# Altium project Thesis_NRF.PrjPcb
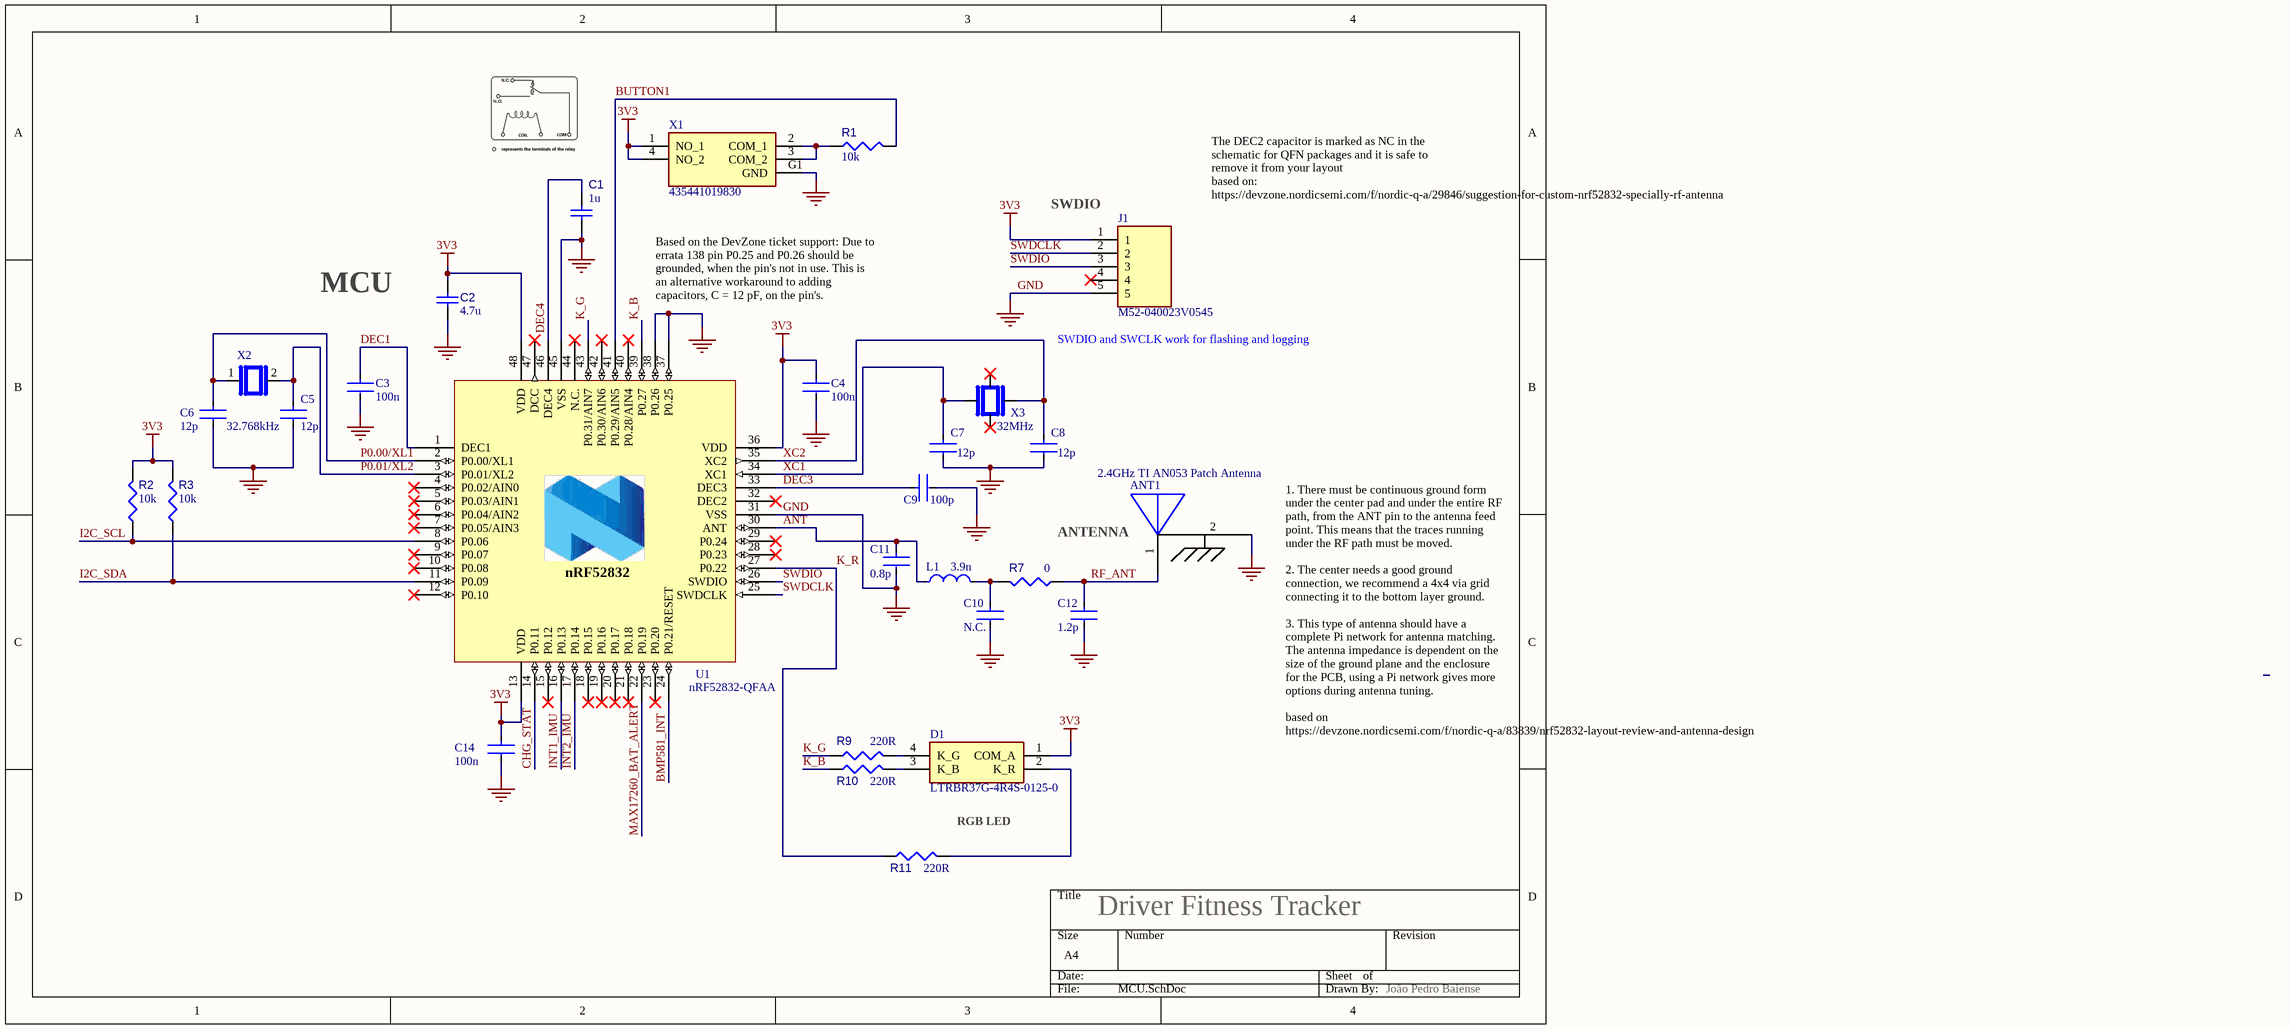
[diagram p0: MCU.SchDoc]
Author: João Pedro Baiense; Date: 14/07/2023; Description: Master's thesis project in Electrotechnical Engineering
3 sheets, 55 parts. Net scope: global (net labels, ports and power ports of the same name join across sheets).
Board file: DriverFitTracker.PcbDoc
Sheets:
  MCU.SchDoc
  PMIC_USB.SchDoc
  SENSORS.SchDoc

## Sheet MCU.SchDoc
size A4; SheetNumber: 1; SheetTotal: 3

### Parts
ANT1  2.4GHz TI AN053 Patch Antenna  [2.4GHz TI AN053 Patch Antenna Right Original]  (no BOM)
C1  1u  [CAPC1608X90X40NL10T20]
C2  4.7u  [CAPC1608X90X40NL10T20]
C3  100n  [FP-C0402-BB-MFG]
C4  100n  [FP-C0402-BB-MFG]
C5  12p  [FP-C0402-BB-MFG]
C6  12p  [FP-C0402-BB-MFG]
C7  12p  [FP-C0402-BB-MFG]
C8  12p  [FP-C0402-BB-MFG]
C9  100p  [FP-C0402-BB-MFG]
C10  N.C.  [FP-C0402-BB-MFG]
C11  0.8p  [FP-C0402-BB-MFG]
C12  1.2p  [FP-C0402-BB-MFG]
C14  100n  [FP-C0402-BB-MFG]
D1  LTRBR37G-4R4S-0125-0  [RGBLED_LTRBR37G4R4S01250]
J1  M52-040023V0545  [5_PINS_HEADER_HDRV5W46P0X127_1X5_635X250X650P]
L1  3.9n  [FP-LQW15AN_00-W0_6-0_1-MFG]
R1  10k  [RESC0402(1005)_L]
R2  10k  [RESC0402(1005)_L]
R3  10k  [RESC0402(1005)_L]
R7  value 0  [RESC0402(1005)_L]  (hidden comment: 0R)
R9  220R  [RESC0402(1005)_L]
R10  220R  [RESC0402(1005)_L]
R11  220R  [RESC0402(1005)_L]
U1  nRF52832-QFAA  [QFN40P600X600X90-48N]
X1  435441019830  [BUTTON_435441019830]
X2  32.768kHz  [CRYSTAL_XTAL_CM8V-T1A-32.768KHZ-9PF-20PPM-TA-QC]
X3  32MHz  [OSC_XRCGB32M000F1H01R0]

### Nets
3V3: C2.1 C4.1 C14.1 D1.1(COM_A) J1.1 R2.2 R3.2 U1.13(VDD) U1.36(VDD) U1.48(VDD) X1.1(NO_1) X1.4(NO_2)  [project net OUT]
GND: ANT1.2 C1.2 C2.2 C3.2 C4.2 C5.2 C6.2 C7.2 C8.2 C9.2 C10.2 C11.2 C12.2 C14.2 J1.5 U1.31(VSS) U1.37(P0.25) U1.38(P0.26) U1.45(VSS) U1.49(GND) X1.G1(GND)
ANT: C11.1 L1.1 U1.30(ANT)
BMP581_INT: U1.24(P0.21/RESET)
BUTTON1: R1.2 U1.41(P0.29/AIN5)
CHG_STAT: U1.14(P0.11)
DEC1: C3.1 U1.1(DEC1)
DEC3: C9.1 U1.33(DEC3)
DEC4: C1.1 U1.46(DEC4)
I2C_SCL: R2.1 U1.8(P0.06)
I2C_SDA: R3.1 U1.11(P0.09)
INT1_IMU: U1.16(P0.13)
INT2_IMU: U1.17(P0.14)
K_B: R10.1 U1.39(P0.27)
K_G: R9.1 U1.43(P0.31/AIN7)
K_R: R11.1 U1.27(P0.22)
MAX17260_BAT_ALERT: U1.22(P0.19)
P0.00/XL1: C6.1 U1.2(P0.00/XL1) X2.1
P0.01/XL2: C5.1 U1.3(P0.01/XL2) X2.2
RF_ANT: ANT1.1(ANT) C12.1 R7.1
SWDCLK: J1.2 U1.25(SWDCLK)
SWDIO: J1.3 U1.26(SWDIO)
XC1: C7.1 U1.34(XC1) X3.1
XC2: C8.1 U1.35(XC2) X3.3
NetC10_1: C10.1 L1.2 R7.2
NetD1_2: D1.2(K_R) R11.2
NetD1_3: D1.3(K_B) R10.2
NetD1_4: D1.4(K_G) R9.2
NetR1_1: R1.1 X1.2(COM_1) X1.3(COM_2)

Not connected (* = marked no-connect by the designer): J1 4*; U1 4(P0.02/AIN0)* 5(P0.03/AIN1)* 6(P0.04/AIN2)* 7(P0.05/AIN3)* 9(P0.07)* 10(P0.08)* 12(P0.10)* 15(P0.12)* 18(P0.15)* 19(P0.16)* 20(P0.17)* 21(P0.18)* 23(P0.20)* 28(P0.23)* 29(P0.24)* 32(DEC2)* 40(P0.28/AIN4)* 42(P0.30/AIN6)* 44(N.C.)* 47(DCC)*; X3 2* 4*

### Notes on the sheet
- (near J1) SWDIO
- The DEC2 capacitor is marked as NC in the schematic for QFN packages and it is safe to remove it from your layout
  based on: https://devzone.nordicsemi.com/f/nordic-q-a/29846/suggestion-for-custom-nrf52832-specially-rf-antenna
- MCU
- Based on the DevZone ticket support: Due to errata 138 pin P0.25 and P0.26 should be grounded, when the pin's not in use. This is an alternative workaround to adding capacitors, C = 12 pF, on the pin's.
- (near J1) SWDIO and SWCLK work for flashing and logging
- ANTENNA
- 1. There must be continuous ground form under the center pad and under the entire RF path, from the ANT pin to the antenna feed point. This means that the traces running under the RF path must be moved.
  2. The center needs a good ground connection, we recommend a 4x4 via grid connecting it to the bottom layer ground.
  3. This type of antenna should have a complete Pi network for antenna matching. The antenna impedance is dependent on the size of the ground plane and the enclosure for the PCB, using a Pi network gives more options during antenna tuning.
  based on https://devzone.nordicsemi.com/f/nordic-q-a/83839/nrf52832-layout-review-and-antenna-design
- Type @ to refer to a designator or a net
- RGB LED
- Driver Fitness Tracker
- João Pedro Baiense
- (in symbol nRF52832_QFAA) nRF52832

### Library data of the parts
ANT1 = 2.4GHz Antenna with GND: From Application Note AN053
C1 = CMP-001-00017-6: Multilayer Ceramic Capacitors MLCC - SMD/SMT 50V 1uF X7R 0603 10%; CorrectManufacturer: 06035C105KAT2A; Tolerance: 10%; Voltage Rating: 50V; Mounting Technology: SM; Value: 1u; Max Operating Temperature: 125°C; RoHS Compliant: True; Pins: 2; Capacitor Type: Ceramic; Case/Package: 0603; Min Operating Temperature: -55°C; JLCPCB Part #: C15849
C2 = CMP-001-00017-6: Chip Capacitor, 100 nF, +/- 10%, 50 V, 0603 (1608 Metric); CorrectManufacturer: 0603YW475KAT2A; Voltage Rating: 50V; Capacitor Type: Ceramic; Tolerance: 10%; Mounting Technology: SM; Value: 4.7u; Max Operating Temperature: 125°C; RoHS Compliant: True; Pins: 2; Case/Package: 0603; Min Operating Temperature: -55°C; JLCPCB Part #: C14663
C3 C4 C14 = CMP-2008-02046-2: Multilayer Ceramic Capacitors MLCC - SMD/SMT NEW GLOBAL PN KGM05CR71H104KN 50V 0.1uF X7R 0402 10%; Manufacturer: Kemet; CorrectManufacturer: 04025C104KAT4A; Capacitance: 0.10 μF; Temperature Characteristic: X5R; Temperature Coefficient: 15%; Tolerance: 0.1; Voltage Rating: 10 V; Value: 0.10 μF; Material: Ceramic; Package: C0402-BB; Temperature: -55°C to +125°C; ComponentLink2Description: Datasheet; Device Class L1: Passive Components; Height: 0.55mm; Lead Free: Yes; ComponentLink2URL: https://content.kemet.com/datasheets/KEM_C1002_X7R_SMD.pdf; Device Class L2: Capacitors; Temperature Range Low: -55°C; Temperature Range High: +125°C; RoHS: TRUE; Octopart: https://octopart.com/c0402c104k8pactu-kemet-140039; Automotive: No; Mouser Description: Capacitor 100 nF 10 VDC 0402; Category: Cap; Digikey Description: CAP CER 0.1UF 10V X5R 0402; Ipc Land Pattern Name: CAPC10050X50; Device Class L3: Ceramic Capacitors; JLCPCB Part #: C1523
C5-C8 = CMP-2008-02046-2: Multilayer Ceramic Capacitors MLCC - SMD/SMT 12 pF 50 VDC 5% 0402 C0G (NP0); Manufacturer: Kemet; CorrectManufacturer: GRM1555C1H120JA01D; Capacitance: 0.10 μF; Temperature Characteristic: X5R; Temperature Coefficient: 15%; Tolerance: 0.1; Voltage Rating: 10 V; Value: 0.10 μF; Material: Ceramic; Package: C0402-BB; Temperature: -55°C to +125°C; ComponentLink2Description: Datasheet; Device Class L1: Passive Components; Height: 0.55mm; Lead Free: Yes; ComponentLink2URL: https://content.kemet.com/datasheets/KEM_C1002_X7R_SMD.pdf; Device Class L2: Capacitors; Temperature Range Low: -55°C; Temperature Range High: +125°C; RoHS: TRUE; Octopart: https://octopart.com/c0402c104k8pactu-kemet-140039; Automotive: No; Mouser Description: Capacitor 100 nF 10 VDC 0402; Category: Cap; Digikey Description: CAP CER 0.1UF 10V X5R 0402; Ipc Land Pattern Name: CAPC10050X50; Device Class L3: Ceramic Capacitors; JLCPCB Part #: C1547
C9 = CMP-2008-02046-2: Multilayer Ceramic Capacitors MLCC - SMD/SMT 100 pF 50 VDC 5% 0402 C0G (NP0); Manufacturer: Kemet; CorrectManufacturer: GRM1555C1H101JA01D; Capacitance: 0.10 μF; Temperature Characteristic: X5R; Temperature Coefficient: 15%; Tolerance: 0.1; Voltage Rating: 10 V; Value: 0.10 μF; Material: Ceramic; Package: C0402-BB; Temperature: -55°C to +125°C; ComponentLink2Description: Datasheet; Device Class L1: Passive Components; Height: 0.55mm; Lead Free: Yes; ComponentLink2URL: https://content.kemet.com/datasheets/KEM_C1002_X7R_SMD.pdf; Device Class L2: Capacitors; Temperature Range Low: -55°C; Temperature Range High: +125°C; RoHS: TRUE; Octopart: https://octopart.com/c0402c104k8pactu-kemet-140039; Automotive: No; Mouser Description: Capacitor 100 nF 10 VDC 0402; Category: Cap; Digikey Description: CAP CER 0.1UF 10V X5R 0402; Ipc Land Pattern Name: CAPC10050X50; Device Class L3: Ceramic Capacitors; JLCPCB Part #: C1546
C10 = CMP-2008-02046-2: DO NOT CONNECT THIS CAPACITOR - RF PURPOSE; CorrectManufacturer: NOT_CONNECT; ComponentLink2Description: Datasheet; ComponentLink2URL: https://content.kemet.com/datasheets/KEM_C1002_X7R_SMD.pdf
C11 = CMP-2008-02046-2: Multilayer Ceramic Capacitors MLCC - SMD/SMT 0.8 pF 50 VDC 0.05 pF 0402 C0G (NP0) AEC-Q200; Manufacturer: Murata Electronics; CorrectManufacturer: GCQ1555C1HR80WB01D; Capacitance: 0.10 μF; Temperature Characteristic: X5R; Temperature Coefficient: 15%; Tolerance: 0.1; Voltage Rating: 10 V; Material: Ceramic; Package: C0402-BB; Temperature: -55°C to +125°C; ComponentLink2Description: Datasheet; Device Class L1: Passive Components; Height: 0.55mm; Lead Free: Yes; ComponentLink2URL: https://content.kemet.com/datasheets/KEM_C1002_X7R_SMD.pdf; Device Class L2: Capacitors; Temperature Range Low: -55°C; Temperature Range High: +125°C; RoHS: TRUE; Octopart: https://octopart.com/c0402c104k8pactu-kemet-140039; Automotive: No; Mouser Description: Capacitor 100 nF 10 VDC 0402; Category: Cap; Digikey Description: CAP CER 0.1UF 10V X5R 0402; Ipc Land Pattern Name: CAPC10050X50; Device Class L3: Ceramic Capacitors; JLCPCB Part #: C172820
C12 = CMP-2008-02046-2: Multilayer Ceramic Capacitors MLCC - SMD/SMT NEW GLOBAL PN KGM05ACG1H1R2BN 50V 1.2pF C0G 0402 .1pF Tol; Manufacturer: Kemet; CorrectManufacturer: 04025A1R2BAT4A; Capacitance: 0.10 μF; Temperature Characteristic: X5R; Temperature Coefficient: 15%; Tolerance: 0.1; Voltage Rating: 10 V; Value: 0.10 μF; Material: Ceramic; Package: C0402-BB; Temperature: -55°C to +125°C; ComponentLink2Description: Datasheet; Device Class L1: Passive Components; Height: 0.55mm; Lead Free: Yes; ComponentLink2URL: https://content.kemet.com/datasheets/KEM_C1002_X7R_SMD.pdf; Device Class L2: Capacitors; Temperature Range Low: -55°C; Temperature Range High: +125°C; RoHS: TRUE; Octopart: https://octopart.com/c0402c104k8pactu-kemet-140039; Automotive: No; Mouser Description: Capacitor 100 nF 10 VDC 0402; Category: Cap; Digikey Description: CAP CER 0.1UF 10V X5R 0402; Ipc Land Pattern Name: CAPC10050X50; Device Class L3: Ceramic Capacitors; JLCPCB Part #: C76955
D1 = RGBLED_LTRBR37G-4R4S-0125-0: Standard LEDs - SMD LTRBR37G; Manufacturer_Name: ams OSRAM; Geometry.Height: 0.35mm; Mouser Part Number: 720-LTRBR37GA6714; Mouser Price/Stock: https://www.mouser.co.uk/ProductDetail/ams-OSRAM/LTRBR37G-4R4S-0125-0?qs=vvQtp7zwQdPO5tl4HQ7ftA%3D%3D; CorrectManufacturer: LTRBR37G-4R4S-0125-0; Datasheet Link: https://dammedia.osram.info/media/resource/hires/osram-dam-24639129/LTRB%20R37G_EN.pdf
J1 = 5_PINS_HEADER_M52-040023V0545: Headers & Wire Housings Pin1.27mm Tail,Vert SIL, 5P, Single Row; Manufacturer_Name: Harwin; Geometry.Height: 6.5mm; CorrectManufacturer: M52-040023V0545; Mouser Part Number: 855-M52-040023V0545; Mouser Price/Stock: https://www.mouser.co.uk/ProductDetail/Harwin/M52-040023V0545?qs=wuXwK9wHm9ubXDya5zRNiw%3D%3D; Arrow Part Number: *; Arrow Price/Stock: *; Datasheet Link: https://cdn.harwin.com/pdfs/M52-040023VXX45.pdf
L1 = CMP-06042-000827-1: RF Inductors - SMD 01005, 3.9nH +-0.2nH S-HQ SMD RF IND; CorrectManufacturer: MHQ0402PSA3N9CT000; Shielding: Unshielded; Self Resonant Frequency: 10GHz; Core Material: Air; Current: 750mA; Test Frequency: 100MHz; DC Resistance (DCR): 70mR; Length: 1mm; Inductance: 3.9nH; Height: 0.5mm; Case Code (Metric): 1005; Lead Free: Lead Free; Military Standard: Not; Mount: Surface Mount; REACH SVHC: No SVHC; Current Rating: 750mA; DC Current: 750mA; Max Operating Temperature: 125°C; Package Quantity: 10000; Packaging: Tape and Reel; Case/Package: 0402; Min Operating Temperature: -55°C; Width: 0.02inch; Depth: 0.7mm; Termination: SMD/SMT; Weight: 2.8E-05oz; Number of Pins: 2; Radiation Hardening: No; Max DC Current: 750mA; JLCPCB Part #: C14033
R1-R3 = CMP-009-00149-3: Thin Film Resistors - SMD 1/16W 10K ohm 1% 50ppm; CorrectManufacturer: RT0402FRE0710KL; Power: 63mW; Min Operating Temperature: -55°C; Tolerance: 1%; Case/Package: 0402; Max Operating Temperature: 155°C; Value: 10k; Pins: 2; JLCPCB Part #: C25744
R7 = CMP-009-00149-3: Thin Film Resistors - SMD MCS 0402 VG01 E1 0R0; CorrectManufacturer: MCS0402HZ0000ZE100; Power: 63mW; Tolerance: 1%; Min Operating Temperature: -55°C; Case/Package: 0402; Max Operating Temperature: 155°C; Pins: 2
R9-R11 = CMP-009-00149-3: Thin Film Resistors - SMD .063W 220ohms 1% 0402 50ppm; CorrectManufacturer: MCS04020C2200FE000; Power: 63mW; Min Operating Temperature: -55°C; Tolerance: 1%; Case/Package: 0402; Max Operating Temperature: 155°C; Value: 220R; Pins: 2; JLCPCB Part #: C25744
U1 = nRF52832_QFAA: Multi-protocol Bluetooth Low Energy, ANT and 2.4GHz proprietary system-on-chip; Manufacturer: Nordic Semiconductor; CorrectManufacturer: nRF52832-QFAA-R; Artikkelnr Noca: N.A.; Part Number: nRF52832-QFAA; Datasheet: *; LatestRevisionDate: 2014-11-26; Pin Count: 48; Publisher: Nordic Semiconductor; Published: 2014-11-26; Value: nRF52832-QFAA; Note: *; Supplier: Nordic Semiconductor; Supplier part number: *; 2nd source Supplier: *; 2nd source part number: *; Footprint Doc: QFN-48; Artikkelnr Simpro: N.A.; JLCPCB Link: https://jlcpcb.com/partdetail/NordicSemicon-NRF52832_QFAAR/C77540; JLCPCB Part #: C77540
X1 = BUTTON_435441019830: Tactile Switches WS-TASV Tact Switch Washable 4.1x2.8x1.9 mm SMT; Manufacturer_Name: Wurth Elektronik; Geometry.Height: 1.9mm; Mouser Part Number: 710-435441019830; Mouser Price/Stock: https://www.mouser.co.uk/ProductDetail/Wurth-Elektronik/435441019830?qs=ufv2HEpFn%252BQgnhl%2FsZ0Vfw%3D%3D; CorrectManufacturer: 435441019830; Datasheet Link: https://www.we-online.com/catalog/datasheet/435441019830.pdf
X2 = CRYSTAL_32K: Crystals 32.768 kHz 9.0 pF +/-20 PPM -40/+85C; CorrectManufacturer: CM8V-T1A-32.768KHZ-9PF-20PPM-TA-QC; MF: Micro Crystal; SnapEDA_Link: https://www.snapeda.com/parts/CM8V-T1A-32.768KHZ-9PF-20PPM-TA-QC/Micro+Crystal/view-part/?ref=snap; Package: SMD-2 Micro Crystal; Value: *; Check_prices: https://www.snapeda.com/parts/CM8V-T1A-32.768KHZ-9PF-20PPM-TA-QC/Micro+Crystal/view-part/?ref=eda
X3 = XRCGB32M000F1H01R0: Crystals 32 MHZ 10PPM 2.0X1.6X; is Basic Part?: No; MF: Murata Electronics; Package: SMD-4 Murata; Availability: In Stock; Value: *; CorrectManufacturer: XRCGB32M000F1H01R0; Purchase-URL: https://pricing.snapeda.com/search/part/XRCGB32M000F1H01R0/?ref=eda; Check_prices: https://www.snapeda.com/parts/XRCGB32M000F1H01R0/Murata/view-part/?ref=eda; Price: None; SnapEDA_Link: https://www.snapeda.com/parts/XRCGB32M000F1H01R0/Murata/view-part/?ref=snap; Available at JLCPCB?: Yes; JLCPCB Link: https://jlcpcb.com/partdetail/985230-XRCGB32M000F1H01R0/C914155; JLCPCB Part #: C914155

## Sheet PMIC_USB.SchDoc
size A4; SheetNumber: 2; SheetTotal: 3
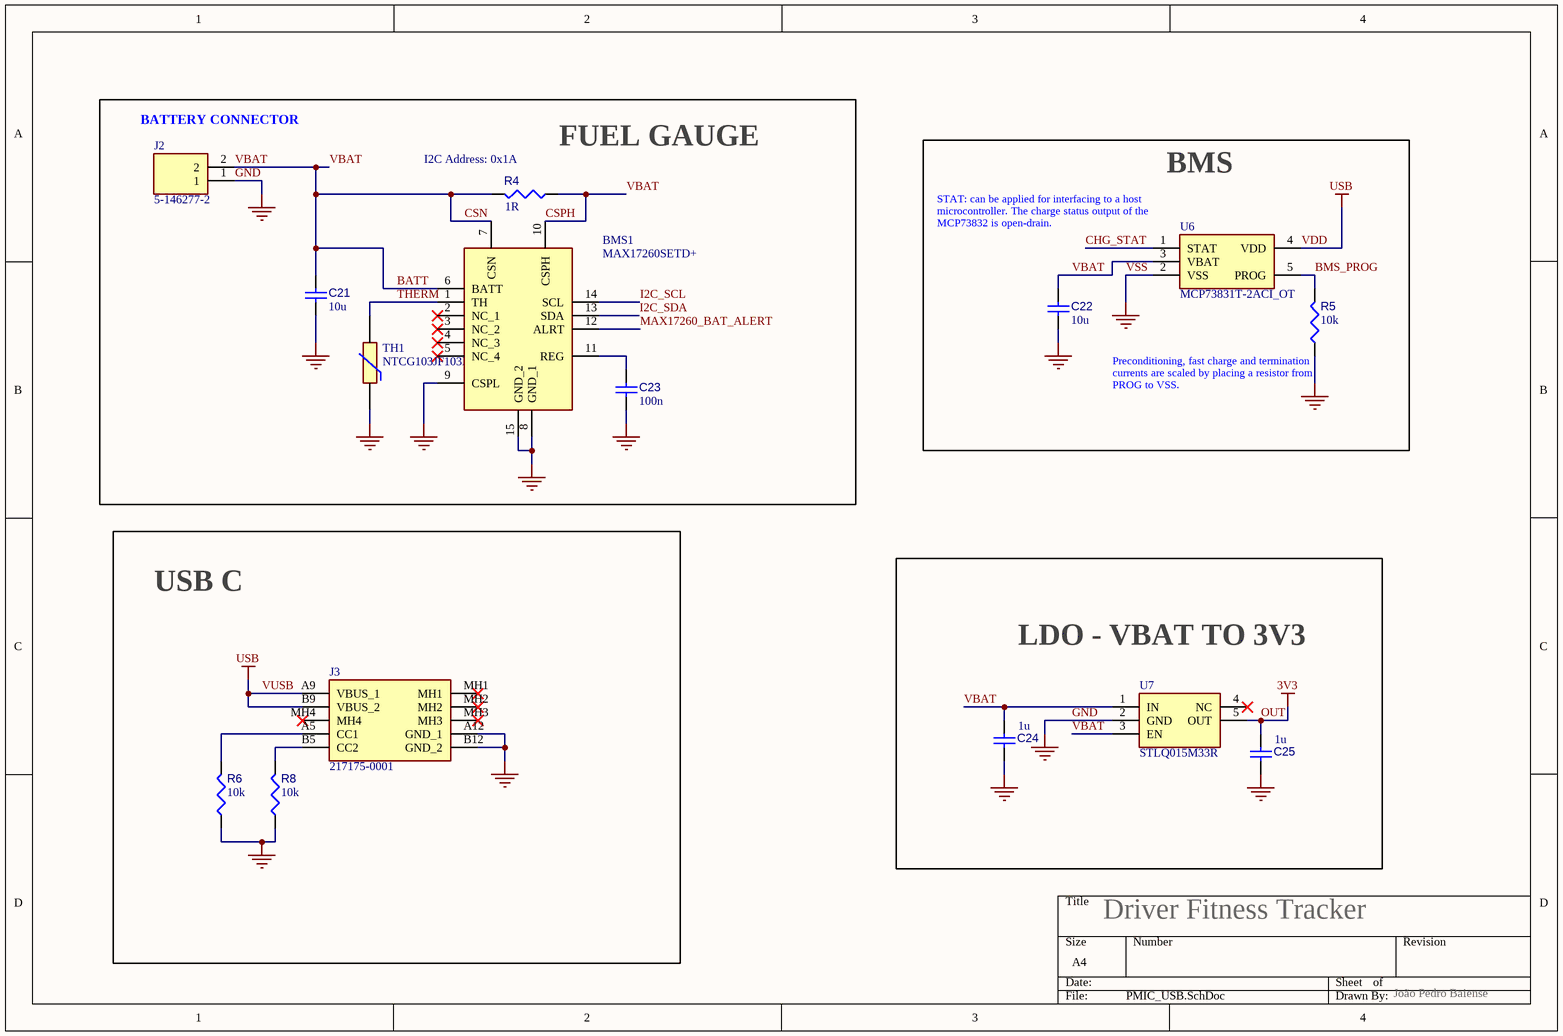
[diagram p1: PMIC_USB.SchDoc]

### Parts
BMS1  MAX17260SETD+  [SON40P300X300X80-15N]
C21  10u  [CAPC1608X90X40NL10T20]
C22  10u  [CAPC1608X90X40NL10T20]
C23  100n  [CAPC1608X90X40NL10T20]
C24  1u  [CAPC1608X90X40NL10T20]
C25  1u  [CAPC1608X90X40NL10T20]
J2  5-146277-2  [HEADER_2PINS]
J3  217175-0001  [USB_C_CONNECTOR]
R4  1R  [RESC0402(1005)_L]
R5  10k  [RESC0402(1005)_L]
R6  10k  [RESC0402(1005)_L]
R8  10k  [RESC0402(1005)_L]
TH1  NTCG103JF103FT1  [THRMC1005X55N]
U6  MCP73831T-2ACI_OT  [SOT95P270X145-5N]
U7  STLQ015M33R  [SOT95P280X145-5N]

### Blocks framed on the sheet
FUEL GAUGE: BMS1 C21 C23 J2 R4 TH1
BMS: C22 R5 U6
USB C: J3 R6 R8
LDO - VBAT TO 3V3: C24 C25 U7

### Nets
GND: BMS1.8(GND_1) BMS1.9(CSPL) BMS1.15(GND_2) C21.2 C22.2 C23.1 C24.2 C25.2 J2.1 J3.A12(GND_1) J3.B12(GND_2) R5.1 R6.1 R8.1 TH1.1 U6.2(VSS) U7.2(GND)  [also labelled VSS]
OUT: C25.1 U7.5(OUT)  [also labelled 3V3]
VDD: J3.A9(VBUS_1) J3.B9(VBUS_2) U6.4(VDD)  [also labelled USB, VUSB]
BATT: BMS1.6(BATT) BMS1.7(CSN) BMS1.10(CSPH) C21.1 C22.1 C24.1 J2.2 R4.1 R4.2 U6.3(VBAT) U7.1(IN) U7.3(EN)  [also labelled CSN, CSPH, VBAT]
BMS_PROG: R5.2 U6.5(PROG)
CHG_STAT: U6.1(STAT)
I2C_SCL: BMS1.14(SCL)
I2C_SDA: BMS1.13(SDA)
MAX17260_BAT_ALERT: BMS1.12(ALRT)
THERM: BMS1.1(TH) TH1.2
NetBMS1_11: BMS1.11(REG) C23.2
NetJ3_A5: J3.A5(CC1) R6.2
NetJ3_B5: J3.B5(CC2) R8.2

Not connected (* = marked no-connect by the designer): BMS1 2(NC_1)* 3(NC_2)* 4(NC_3)* 5(NC_4)*; J3 MH1* MH2* MH3* MH4*; U7 4(NC)*

### Notes on the sheet
- (near J2) BATTERY CONNECTOR
- (near R4) I2C Address: 0x1A
- (near U6) STAT: can be applied for interfacing to a host microcontroller. The charge status output of the MCP73832 is open-drain.
- (near R5) Preconditioning, fast charge and termination currents are scaled by placing a resistor from PROG to VSS.
- Driver Fitness Tracker
- João Pedro Baiense

### Library data of the parts
BMS1 = MAX17260SETD+: Battery Management 5.1 A 1-Cell Fuel Gauge with ModelGauge m5 EZ and Optional High-Side Current Sensing; Manufacturer_Name: Analog Devices; Geometry.Height: 0.8mm; Mouser Part Number: 700-MAX17260SETD+; Mouser Price/Stock: https://www.mouser.co.uk/ProductDetail/Analog-Devices-Maxim-Integrated/MAX17260SETD%2b?qs=%252BEew9%252B0nqrAfepKB1Fe0%252Bw%3D%3D; CorrectManufacturer: MAX17260SETD+; Datasheet Link: https://www.maximintegrated.com/en/ds/MAX17260.pdf; Available at JLCPCB?: Yes; JLCPCB Part #: C350946
C21 C22 = CMP-001-00017-6: Multilayer Ceramic Capacitors MLCC - SMD/SMT NEW GLOBAL PN KGM15CR51C106MT 0603; CorrectManufacturer: 0603YD106MAT2A; Tolerance: 10%; Voltage Rating: 50V; Mounting Technology: SM; Value: 10u; Max Operating Temperature: 125°C; RoHS Compliant: True; Pins: 2; Capacitor Type: Ceramic; Case/Package: 0603; JLCPCB Part #: C19702
C23 = CMP-001-00017-6: Multilayer Ceramic Capacitors MLCC - SMD/SMT 50V 0.1 uF X7R 0603 10% AEC-Q200; CorrectManufacturer: KAM15AR71H104KT; Tolerance: 10%; Voltage Rating: 50V; Mounting Technology: SM; Value: 100n; Max Operating Temperature: 125°C; RoHS Compliant: True; Pins: 2; Capacitor Type: Ceramic; Case/Package: 0603; JLCPCB Part #: C1523
C24 C25 = CMP-001-00017-6: as C1 on sheet MCU; Tolerance: 10%; Voltage Rating: 50V; Mounting Technology: SM; Value: 1u; Max Operating Temperature: 125°C; RoHS Compliant: True; Pins: 2; Capacitor Type: Ceramic; Case/Package: 0603; JLCPCB Part #: C15849
J2 = BATT_CONN_1: Headers & Wire Housings 2P HEADER GOLD 30u single row; Manufacturer_Name: TE Connectivity; Geometry.Height: 8.23mm; CorrectManufacturer: 5-146277-2; Mouser Part Number: 571-5-146277-2; Mouser Price/Stock: https://www.mouser.co.uk/ProductDetail/TE-Connectivity/5-146277-2?qs=bwpFY26eRVdSYoepUea0uA%3D%3D; Arrow Part Number: 5-146277-2; Arrow Price/Stock: https://www.arrow.com/en/products/5-146277-2/te-connectivity?region=nac; Datasheet Link: https://www.te.com/commerce/DocumentDelivery/DDEController?Action=srchrtrv&DocNm=146277&DocType=Customer+Drawing&DocLang=English
J3 = USB_C_CONNECTOR: USB Connectors Top-Mnt SMT 6Ckt Type C Rec Molex; Geometry.Height: 3.46mm; Manufacturer_Name: Molex; CorrectManufacturer: 217175-0001; Mouser Part Number: 538-217175-0001; Mouser Price/Stock: https://www.mouser.co.uk/ProductDetail/Molex/217175-0001?qs=DRkmTr78QARWJMiqNnldSg%3D%3D; Arrow Part Number: *; Arrow Price/Stock: *; Datasheet Link: https://www.molex.com/pdm_docs/sd/2171750001_sd.pdf
R4 = CMP-009-00149-3: Thin Film Resistors - SMD .1W 1.0ohm 1% 0402 50ppm; CorrectManufacturer: MCS0402MC1008FE000; Power: 63mW; Min Operating Temperature: -55°C; Tolerance: 1%; Case/Package: 0402; Max Operating Temperature: 155°C; Value: 1R; Pins: 2
R5 R6 R8 = CMP-009-00149-3: as R1 on sheet MCU; Min Operating Temperature: -55°C; Tolerance: 1%; Case/Package: 0402; Max Operating Temperature: 155°C; Value: 10k; Pins: 2; JLCPCB Part #: C25744
TH1 = NTCG103JF103FT1: NTC (Negative Temperature Coefficient) Thermistors THERMISTOR, NTC 10K OHM, 1%, 0402; Manufacturer_Name: TDK; Geometry.Height: 0.55mm; Mouser Part Number: 810-NTCG103JF103FT1; Mouser Price/Stock: https://www.mouser.co.uk/ProductDetail/TDK/NTCG103JF103FT1?qs=f0gCvUGw%252BIwLiM8IfZktlg%3D%3D; CorrectManufacturer: NTCG103JF103FT1; Datasheet Link: https://product.tdk.com/system/files/dam/doc/product/sensor/ntc/chip-ntc-thermistor/catalog/tpd_commercial_ntc-thermistor_ntcg_en.pdf; JLCPCB Link: https://jlcpcb.com/partdetail/Tdk-NTCG103JF103FT1/C209959; Available at JLCPCB?: Yes; JLCPCB Part #: C209959
U6 = MCP73831T-2ACI_OT: Battery Management Charge mgnt contr; Manufacturer_Name: Microchip; CorrectManufacturer: MCP73831T-2ACI/OT; Geometry.Height: 1.45mm; Mouser Part Number: 579-MCP73831T-2ACIOT; Mouser Price/Stock: https://www.mouser.co.uk/ProductDetail/Microchip-Technology/MCP73831T-2ACI-OT?qs=yUQqVecv4qvbBQBGbHx0Mw%3D%3D; Arrow Part Number: MCP73831T-2ACI/OT; Arrow Price/Stock: https://www.arrow.com/en/products/mcp73831t-2aciot/microchip-technology?region=nac; Datasheet Link: http://ww1.microchip.com/downloads/en/DeviceDoc/20001984g.pdf; Available at JLCPCB?: Yes; JLCPCB Part #: C424093
U7 = STLQ015M33R: LDO Voltage Regulators 150 mA - ultra low quiescent current linear voltage regulator; Manufacturer_Name: STMicroelectronics; Geometry.Height: 1.45mm; Mouser Part Number: 511-STLQ015M33R; Mouser Price/Stock: https://www.mouser.co.uk/ProductDetail/STMicroelectronics/STLQ015M33R?qs=k5OWtXsTJaojAOdVSaZ6wQ%3D%3D; CorrectManufacturer: STLQ015M33R; Datasheet Link: https://rs.componentsearchengine.com/Datasheets/2/STLQ015M33R.pdf; JLCPCB Link: https://jlcpcb.com/partdetail/Stmicroelectronics-STLQ015M33R/C136154; JLCPCB Part #: C136154

## Sheet SENSORS.SchDoc
size A4; SheetNumber: 3; SheetTotal: 3
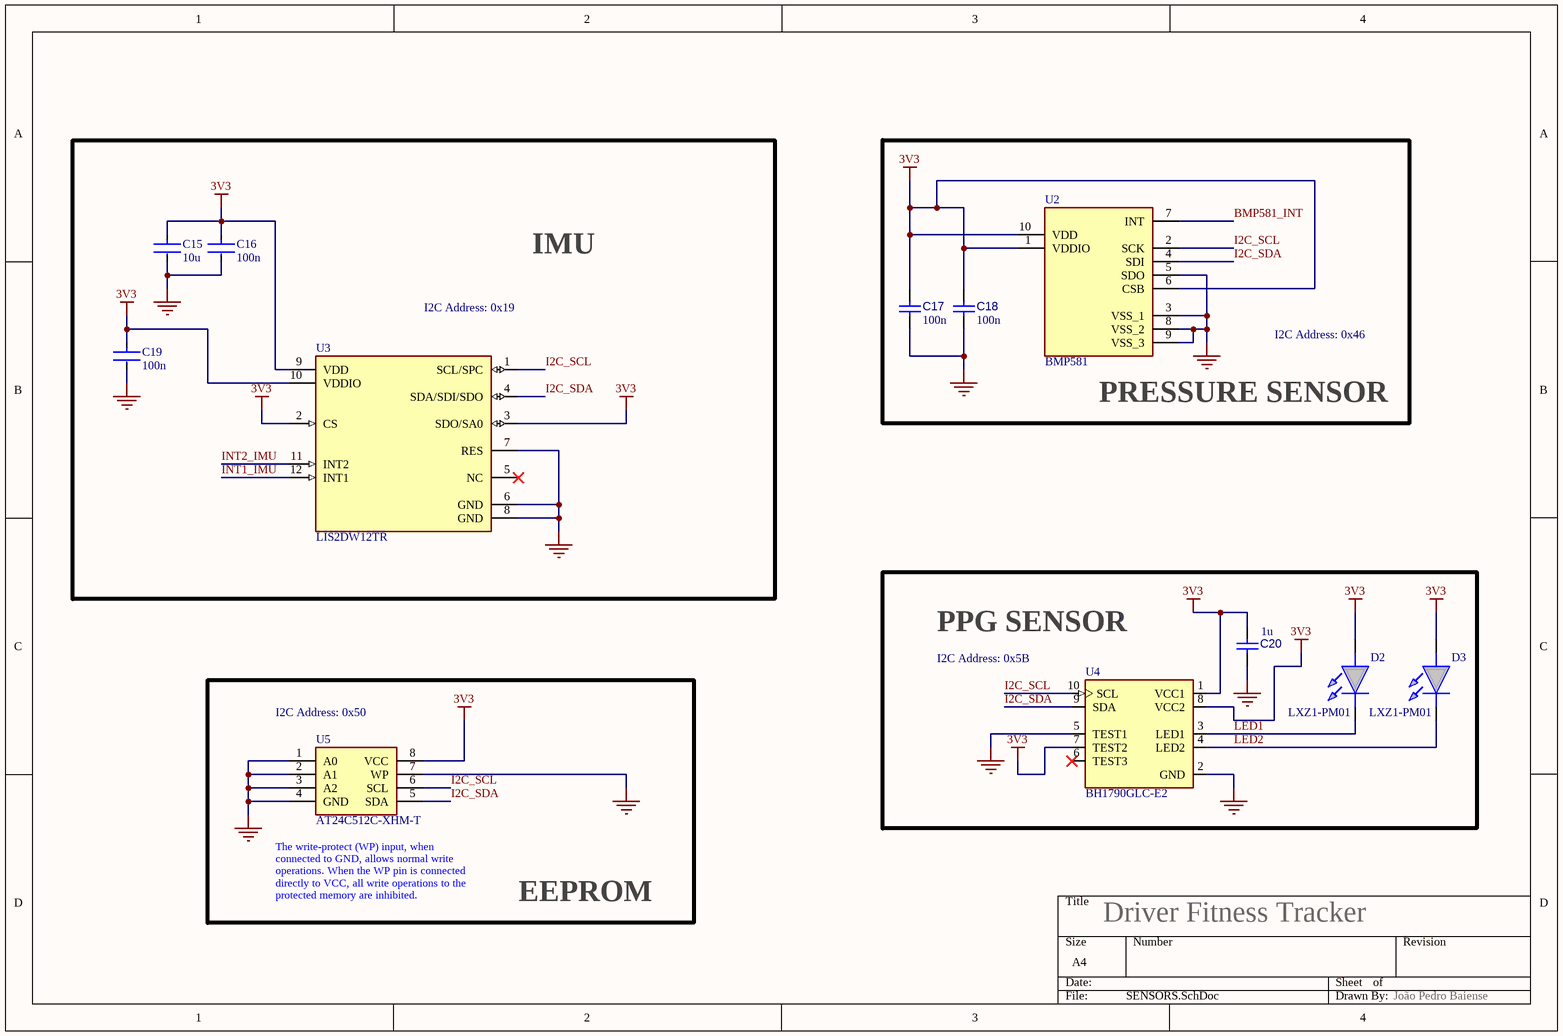
[diagram p2: SENSORS.SchDoc]

### Parts
C15  10u  [FP-C0402-BB-MFG]
C16  100n  [FP-C0402-BB-MFG]
C17  100n  [CAPC1608X90X40NL10T20]
C18  100n  [CAPC1608X90X40NL10T20]
C19  100n  [FP-C0402-BB-MFG]
C20  1u  [CAPC1608X90X40NL10T20]
D2  LXZ1-PM01  [LEDC1608X70N]
D3  LXZ1-PM01  [LEDC1608X70N]
U2  BMP581  [BMP581]
U3  LIS2DW12TR  [FP-LGA12-DM00170568-MFG]
U4  BH1790GLC-E2  [PQFN70P280X280X100-10N]
U5  AT24C512C-XHM-T  [SOP65P640X120-8N]

### Blocks framed on the sheet
IMU: C15 C16 C19 U3
PRESSURE SENSOR: C17 C18 U2
PPG SENSOR: C20 D2 D3 U4
EEPROM: U5

### Nets
3V3: C15.1 C16.1 C17.2 C18.2 C19.1 C20.1 D2.2(A) D3.2(A) U2.1(VDDIO) U2.6(CSB) U2.10(VDD) U3.2(CS) U3.3(SDO/SA0) U3.9(VDD) U3.10(VDDIO) U4.1(VCC1) U4.7(TEST2) U4.8(VCC2) U5.8(VCC)  [project net OUT]
GND: C15.2 C16.2 C17.1 C18.1 C19.2 C20.2 U2.3(VSS_1) U2.5(SDO) U2.8(VSS_2) U2.9(VSS_3) U3.6(GND) U3.7(RES) U3.8(GND) U4.2(GND) U4.5(TEST1) U5.1(A0) U5.2(A1) U5.3(A2) U5.4(GND) U5.7(WP)
BMP581_INT: U2.7(INT)
I2C_SCL: U2.2(SCK) U3.1(SCL/SPC) U4.10(SCL) U5.6(SCL)
I2C_SDA: U2.4(SDI) U3.4(SDA/SDI/SDO) U4.9(SDA) U5.5(SDA)
INT1_IMU: U3.12(INT1)
INT2_IMU: U3.11(INT2)
LED1: D2.1(K) U4.3(LED1)
LED2: D3.1(K) U4.4(LED2)

Not connected (* = marked no-connect by the designer): U3 5(NC)*; U4 6(TEST3)*

### Notes on the sheet
- I2C Address: 0x19
- I2C Address: 0x46
- (near U5) I2C Address: 0x50
- (near U4) I2C Address: 0x5B
- (near U5) The write-protect (WP) input, when connected to GND, allows normal write operations. When the WP pin is connected
  directly to VCC, all write operations to the protected memory are inhibited.
- Driver Fitness Tracker
- João Pedro Baiense

### Library data of the parts
C15 = CMP-2008-02046-2: Multilayer Ceramic Capacitors MLCC - SMD/SMT 10 uF 6.3 VDC 20% 0402 X5R; Manufacturer: Kemet; CorrectManufacturer: GRM155R60J106ME05D; Capacitance: 0.10 μF; Temperature Coefficient: 15%; Tolerance: 0.1; Voltage Rating: 10 V; Value: 0.10 μF; Material: Ceramic; Package: C0402-BB; Temperature: -55°C to +125°C; ComponentLink2Description: Datasheet; Temperature Characteristic: X5R; Device Class L1: Passive Components; Height: 0.55mm; Lead Free: Yes; ComponentLink2URL: https://content.kemet.com/datasheets/KEM_C1002_X7R_SMD.pdf; Device Class L2: Capacitors; Temperature Range Low: -55°C; Temperature Range High: +125°C; RoHS: TRUE; Octopart: https://octopart.com/c0402c104k8pactu-kemet-140039; Automotive: No; Mouser Description: Capacitor 100 nF 10 VDC 0402; Category: Cap; Digikey Description: CAP CER 0.1UF 10V X5R 0402; Ipc Land Pattern Name: CAPC10050X50; Device Class L3: Ceramic Capacitors; JLCPCB Part #: C19702
C16 C19 = CMP-2008-02046-2: as C3 on sheet MCU; Material: Ceramic; Package: C0402-BB; Temperature: -55°C to +125°C; ComponentLink2Description: Datasheet; Device Class L1: Passive Components; Height: 0.55mm; Lead Free: Yes; ComponentLink2URL: https://content.kemet.com/datasheets/KEM_C1002_X7R_SMD.pdf; Device Class L2: Capacitors; Temperature Range Low: -55°C; Temperature Range High: +125°C; RoHS: TRUE; Octopart: https://octopart.com/c0402c104k8pactu-kemet-140039; Automotive: No; Mouser Description: Capacitor 100 nF 10 VDC 0402; Category: Cap; Digikey Description: CAP CER 0.1UF 10V X5R 0402; Ipc Land Pattern Name: CAPC10050X50; Device Class L3: Ceramic Capacitors; JLCPCB Part #: C1523
C17 C18 = CMP-001-00017-6: as C23 on sheet PMIC_USB; Tolerance: 10%; Voltage Rating: 50V; Mounting Technology: SM; Value: 100n; Max Operating Temperature: 125°C; RoHS Compliant: True; Pins: 2; Capacitor Type: Ceramic; Case/Package: 0603; JLCPCB Part #: C1523
C20 = CMP-001-00017-6: as C1 on sheet MCU; Tolerance: 10%; Voltage Rating: 50V; Mounting Technology: SM; Value: 1u; Max Operating Temperature: 125°C; RoHS Compliant: True; Pins: 2; Capacitor Type: Ceramic; Case/Package: 0603; JLCPCB Part #: C15849
D2 = LED_19-217/GHC-YR1S2/3T: Standard LEDs - SMD Brilliant Green Everlight; Geometry.Height: 0.96mm; Mouser Part Number: 638-19217GHCYR1S23T; Mouser Price/Stock: https://pt.mouser.com/ProductDetail/Everlight/19-217-GHC-YR1S2-3T?qs=8cKuZ6Ok2lZjmFTUzVFjDg%3D%3D; Manufacturer_Name: Everlight; CorrectManufacturer: 19-217/GHC-YR1S2/3T; Datasheet Link: https://pt.mouser.com/datasheet/2/143/19-217-GHC-YR1S2-3T-1663276.pdf; JLCPCB Link: https://jlcpcb.com/partdetail/EverlightElec-19_217_GHC_YR1S23T/C72043; Available at JLCPCB?: Yes; JLCPCB Part #: C72043
D3 = LED_19-217/GHC-YR1S2/3T: High Power LEDs - Single Color Green; Manufacturer_Name: Everlight; Geometry.Height: 0.96mm; Mouser Part Number: 638-19217GHCYR1S23T; Mouser Price/Stock: https://pt.mouser.com/ProductDetail/Everlight/19-217-GHC-YR1S2-3T?qs=8cKuZ6Ok2lZjmFTUzVFjDg%3D%3D; CorrectManufacturer: 19-217/GHC-YR1S2/3T; Datasheet Link: https://pt.mouser.com/datasheet/2/143/19-217-GHC-YR1S2-3T-1663276.pdf; JLCPCB Link: https://jlcpcb.com/partdetail/EverlightElec-19_217_GHC_YR1S23T/C72043; Available at JLCPCB?: Yes; JLCPCB Part #: C72043
U2 = BMP581: Board Mount Pressure Sensors The BMP581 is a very small, low-power and low-noise 24-bit absolute barometric pressure sensor; Manufacturer_Name: BOSCH; Geometry.Height: 0.8mm; Mouser Part Number: 262-BMP581; Mouser Price/Stock: https://www.mouser.co.uk/ProductDetail/Bosch-Sensortec/BMP581?qs=Li%252BoUPsLEntPL9tlFmcgXg%3D%3D; CorrectManufacturer: BMP581; Datasheet Link: https://www.bosch-sensortec.com/media/boschsensortec/downloads/datasheets/bst-bmp581-ds004.pdf
U3 = CMP-12175-000006-1: ACCEL 2-16G I2C/SPI 12LGA STMicroelectronics; Min Supply Voltage: 1.62V; Operating Supply Current: 0.38-90uA; Sensor Output: I2C,SPI; Accel Resolution: 14bits; Max Supply Voltage: 3.6V; Accel Range: 2/4/8/16g; Height: 0.7mm; Device Class L1: Sensors; RoHS: TRUE; Temperature Range Low: -40°C; Category: IC; Mouser Description: Accelerometer Triple ±2g/±4g/±8g/±16g 1.62V to 3.6V 0.244mg/digit/0.488mg/digit/0.976mg/digit/1.952mg/digit 12-Pin LG...; Digikey Description: ACCEL 2-16G I2C/SPI 12LGA; ComponentLink2URL: https://www.st.com/resource/en/datasheet/lis2dw12.pdf; Automotive: No; CorrectManufacturer: LIS2DW12TR; Lead Free: Yes; Footprint Url: https://www.st.com/content/ccc/resource/technical/document/technical_note/73/17/9c/16/dd/96/4a/01/CD00134799.pdf/files/CD00134799.pdf/jcr:content/translations/en.CD00134799.pdf; Temperature: -40°C to +85°C; Device Class L3: Accelerometers; Package: LGA12-DM00170568; Temperature Range High: +85°C; Device Class L2: Motion Sensors; Octopart: https://octopart.com/lis2dw12tr-stmicroelectronics-77080925; ComponentLink2Description: Datasheet; Manufacturer: STMicroelectronics; JLCPCB Link: https://jlcpcb.com/partdetail/Stmicroelectronics-LIS2DW12TR/C189624; JLCPCB Part #: C189624
U4 = BH1790GLC-E2: Light To Frequency & Light To Voltage Opt Sensr Heart Rate Monitor IC 200uA; MF: Rohm; Package: LGA-10 Rohm; CorrectManufacturer: BH1790GLC-E2; Mouser-Purchase-URL: https://snapeda.com/shop?store=Mouser&id=2761766; Price: None; Availability: Warning; Value: *; SnapEDA_Link: https://www.snapeda.com/parts/BH1790GLC-E2/Rohm/view-part/2761766/?ref=snap; JLCPCB Link: None; Available at JLCPCB?: No
U5 = AT24C512C-XHM-T: EEPROM SERIAL EEPROM 512K (64K X 8) 2WIRE 1.7V; Manufacturer_Name: Microchip; Geometry.Height: 1.2mm; Mouser Part Number: 556-AT24C512C-XHM-T; Mouser Price/Stock: https://www.mouser.co.uk/ProductDetail/Microchip-Technology/AT24C512C-XHM-T?qs=rNaVQffb%252BteaIrq7vigEzw%3D%3D; CorrectManufacturer: AT24C512C-XHM-T; Datasheet Link: https://ww1.microchip.com/downloads/en/DeviceDoc/20006161B.pdf; Available at JLCPCB?: YES; JLCPCB Linkl: https://jlcpcb.com/partdetail/MicrochipTech-AT24C512C_XHMT/C111546; JLCPCB Part #: C111546

## Nets that join several sheets
GND: MCU (21 pins), PMIC_USB (17 pins), SENSORS (20 pins)
OUT: MCU (12 pins), PMIC_USB (C25.1 U7.5), SENSORS (19 pins)
BMP581_INT: MCU (U1.24), SENSORS (U2.7)
CHG_STAT: MCU (U1.14), PMIC_USB (U6.1)
I2C_SCL: MCU (R2.1 U1.8), PMIC_USB (BMS1.14), SENSORS (U2.2 U3.1 U4.10 U5.6)
I2C_SDA: MCU (R3.1 U1.11), PMIC_USB (BMS1.13), SENSORS (U2.4 U3.4 U4.9 U5.5)
INT1_IMU: MCU (U1.16), SENSORS (U3.12)
INT2_IMU: MCU (U1.17), SENSORS (U3.11)
MAX17260_BAT_ALERT: MCU (U1.22), PMIC_USB (BMS1.12)